# EAGLE design rako-bridge (EAGLE 6.4)
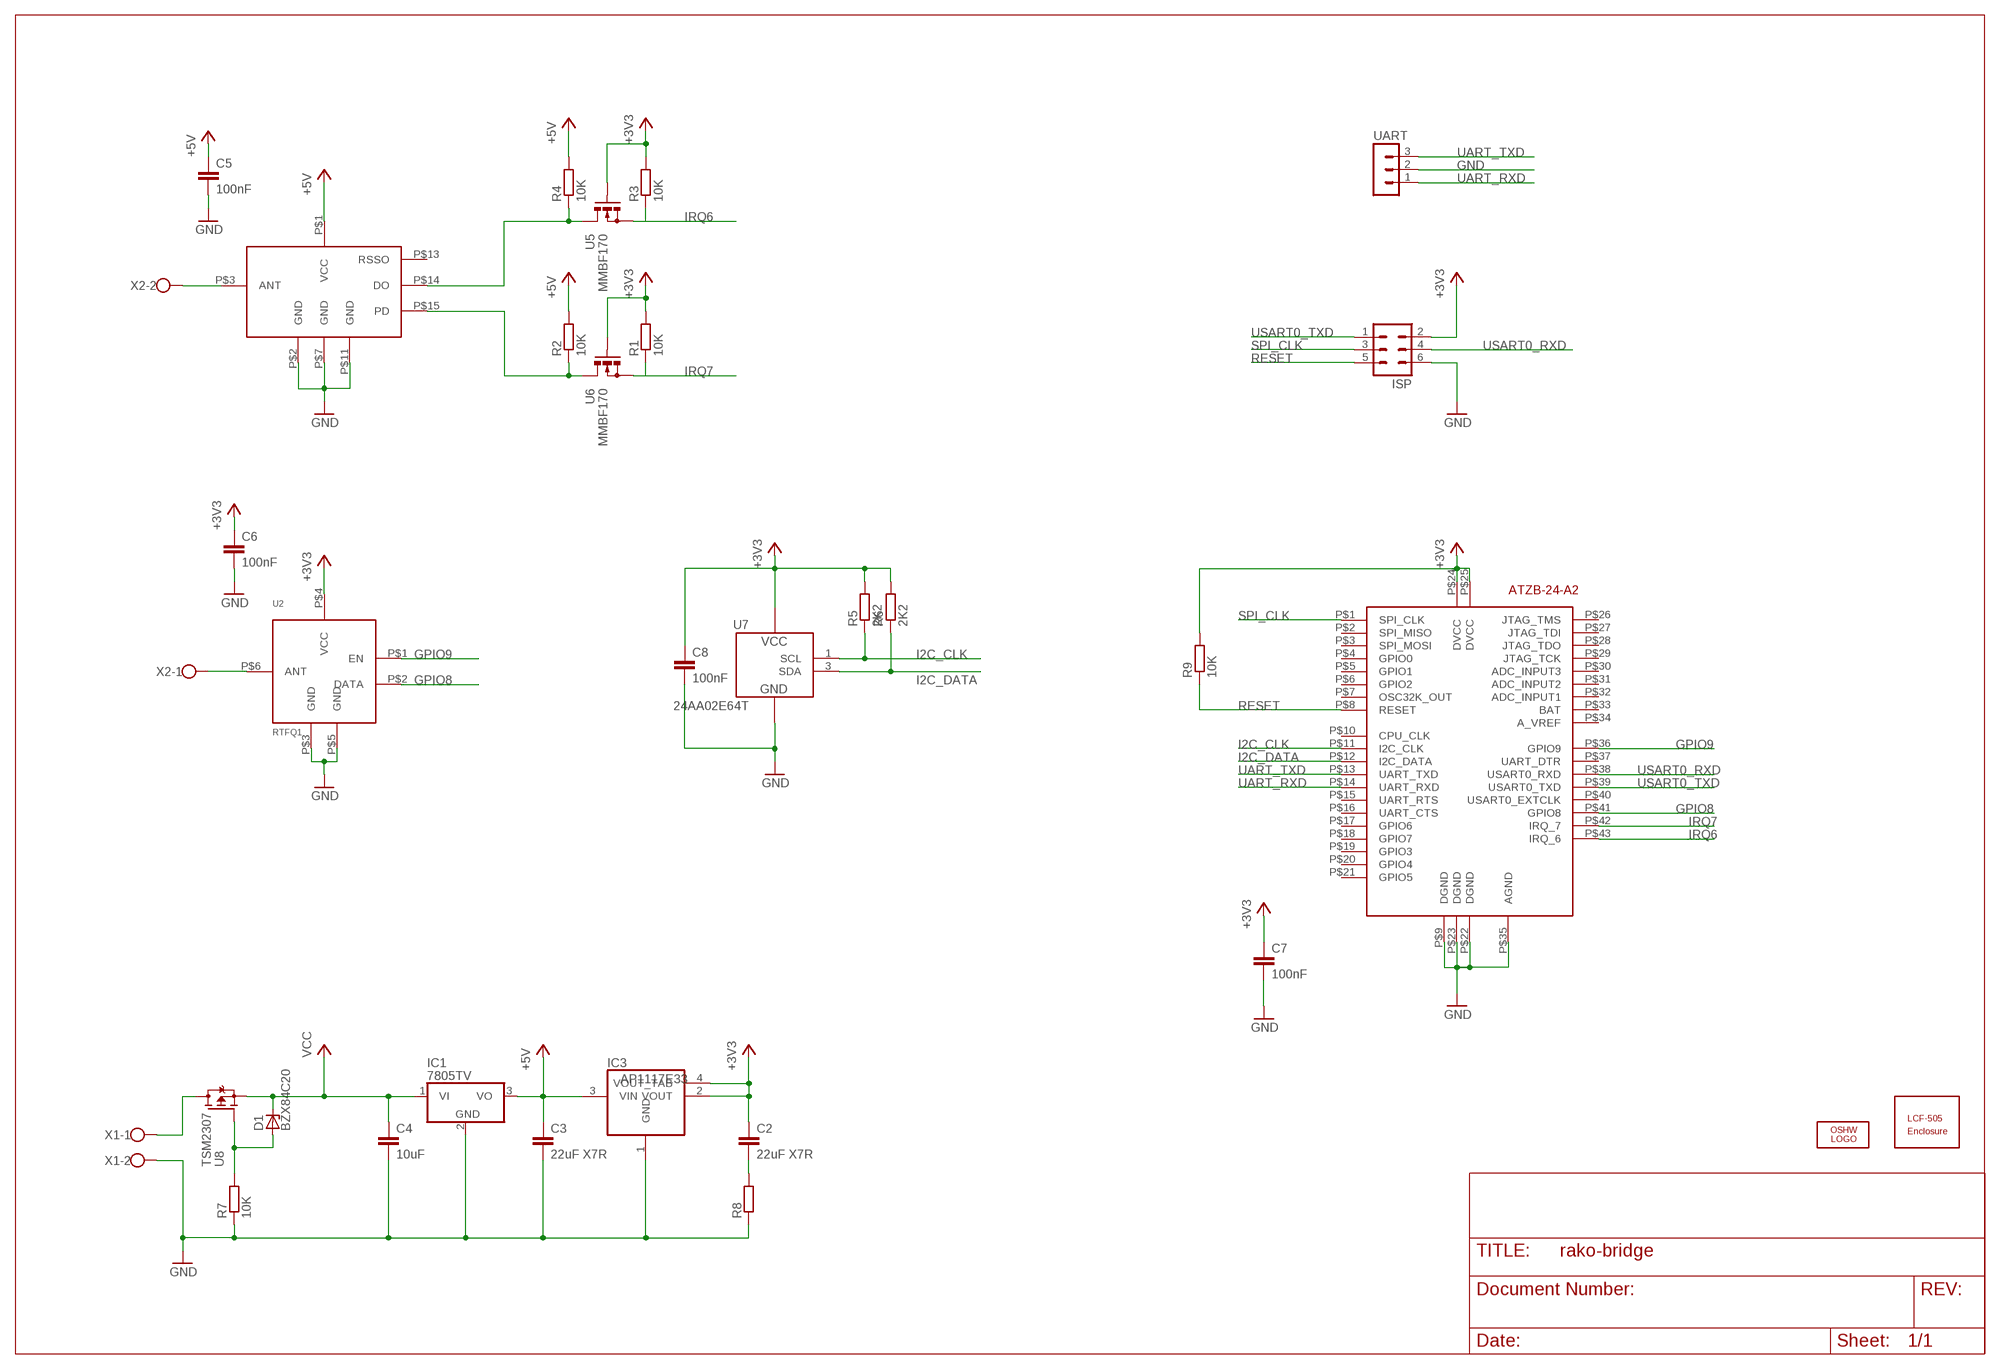
[diagram p0: schematic, sheet 1]

## Parts
C2  22uF X7R  C-EUC1210  [C1210]
C3  22uF X7R  C-EUC1210  [C1210]
C4  10uF  C-EUC1210  [C1210]
C5  100nF  C-EUC0603  [C0603]
C6  100nF  C-EUC0603  [C0603]
C7  100nF  C-EUC0603  [C0603]
C8  100nF  C-EUC0603  [C0603]
D1  BZX84C20  BZX84C  [SOT23]
IC1  7805TV  [TO220V]
IC3  AP1117E33  REG1117  [SOT223]
ISP  MA03-2  [MA03-2]
LOGO1  OSHW_LOGO_FILLX0200-NT  [OSHW_FILLX200_NOTEXT]
R1  10K  R-EU_R0603  [R0603]
R2  10K  R-EU_R0603  [R0603]
R3  10K  R-EU_R0603  [R0603]
R4  10K  R-EU_R0603  [R0603]
R5  2K2  R-EU_R0603  [R0603]
R6  2K2  R-EU_R0603  [R0603]
R7  10K  R-EU_R0603  [R0603]
R8  R-EU_R0603  [R0603]
R9  10K  R-EU_R0603  [R0603]
U2  RTFQ1  [RTFQ1]
U4  RRFQ1  [RRFQ1]
U5  MMBF170  [SOT23]
U6  MMBF170  [SOT23]
U7  24AA02E64T  [SOT23-5L]
U8  TSM2307  [SOT23]
U$1  BOX-LCF-505  [BOX-LCF-505]
U$3  ATZB-24-A2  [ATZB-24-A2]
UART  MA03-1  [MA03-1]
X1  W237-102  [W237-102]
X2  W237-102  [W237-102]

## Nets
+3V3: C2.1 C6.1 C7.1 C8.1 IC3.2(VOUT) IC3.4(VOUT_TAB) ISP.2 R1.2 R3.2 R5.2 R6.2 R9.2 U2.P$4(VCC) U5.1(G) U6.1(G) U7.4(VCC) U$3.P$24(DVCC) U$3.P$25(DVCC)
+5V: C3.1 C5.1 IC1.3(VO) IC3.3(VIN) R2.2 R4.2 U4.P$1(VCC)
GND: C3.2 C4.2 C5.2 C6.2 C7.2 C8.2 IC1.2(GND) IC3.1(GND) ISP.6 R7.1 R8.1 U2.P$3(GND) U2.P$5(GND) U4.P$2(GND) U4.P$7(GND) U4.P$11(GND) U7.2(VSS) U$3.P$9(DGND) U$3.P$22(DGND) U$3.P$23(DGND) U$3.P$35(AGND) UART.2 X1.2
GPIO8: U2.P$2(DATA) U$3.P$41(GPIO8)
GPIO9: U2.P$1(EN) U$3.P$36(GPIO9)
I2C_CLK: R5.1 U7.1(SCL) U$3.P$11(I2C_CLK)
I2C_DATA: R6.1 U7.3(SDA) U$3.P$12(I2C_DATA)
IRQ6: R3.1 U5.2(S) U$3.P$43(IRQ_6)
IRQ7: R1.1 U6.2(S) U$3.P$42(IRQ_7)
N$1: U4.P$3(ANT) X2.2
N$2: U2.P$6(ANT) X2.1
N$3: D1.1(A) R7.2 U8.1(G)
N$4: U8.3(D) X1.1
N$5: R2.1 U4.P$15(PD) U6.3(D)
N$7: R4.1 U4.P$14(DO) U5.3(D)
N$9: C2.2 R8.2
RESET: ISP.5 R9.1 U$3.P$8(RESET)
SPI_CLK: ISP.3 U$3.P$1(SPI_CLK)
UART_RXD: U$3.P$14(UART_RXD) UART.1
UART_TXD: U$3.P$13(UART_TXD) UART.3
USART0_RXD: ISP.4 U$3.P$38(USART0_RXD)
USART0_TXD: ISP.1 U$3.P$39(USART0_TXD)
VCC: C4.1 D1.3(C) IC1.1(VI) U8.2(S)
Unconnected: U4.P$13(RSSO) U$3.P$2(SPI_MISO) U$3.P$3(SPI_MOSI) U$3.P$4(GPIO0) U$3.P$5(GPIO1) U$3.P$6(GPIO2) U$3.P$7(OSC32K_OUT) U$3.P$10(CPU_CLK) U$3.P$15(UART_RTS) U$3.P$16(UART_CTS) U$3.P$17(GPIO6) U$3.P$18(GPIO7) U$3.P$19(GPIO3) U$3.P$20(GPIO4) U$3.P$21(GPIO5) U$3.P$26(JTAG_TMS) U$3.P$27(JTAG_TDI) U$3.P$28(JTAG_TDO) U$3.P$29(JTAG_TCK) U$3.P$30(ADC_INPUT3) U$3.P$31(ADC_INPUT2) U$3.P$32(ADC_INPUT1) U$3.P$33(BAT) U$3.P$34(A_VREF) U$3.P$37(UART_DTR) U$3.P$40(USART0_EXTCLK)

## Library data of the parts
C2-C8 = resistor:C-EU: CAPACITOR, European symbol
D1 = __SR:BZX84C: Z DIODE
IC1 = linear:78*: Positive VOLTAGE REGULATOR Source: http://cache.national.com/ds/LM/LM78L05.pdf http://www.fairchildsemi.com/ds/LM/LM7805.pdf
IC3 = burr-brown:REG1117: 800mA and 1A Low Dropout (LDO) Positive Regulator 1.8V, 2.5V, 2.85V, 3.3V, 5V, and Adj; MPN: REG1117; OC_FARNELL: 1097566; OC_NEWARK: 14P6981
ISP = con-lstb:MA03-2: PIN HEADER; OC_FARNELL: unknown; OC_NEWARK: unknown
LOGO1 = ohw-logo:OSHW_LOGO_FILL
R1-R9 = resistor:R-EU_: RESISTOR, European symbol
U2 = __SR:RTFQ1
U4 = __SR:RRFQ1
U5 U6 = __SR:MMBF170
U7 = __SR:24AA02E64T
U8 = __SR:TSM2307
U$1 = __SR:BOX-LCF-505
U$3 = __SR:ATZB-24-A2
UART = con-lstb:MA03-1: PIN HEADER; OC_FARNELL: unknown; OC_NEWARK: unknown
X1 X2 = con-wago-500:W237-102: WAGO SCREW CLAMP; MPN: 237-102; OC_FARNELL: unknown; OC_NEWARK: 70K9898

## Board
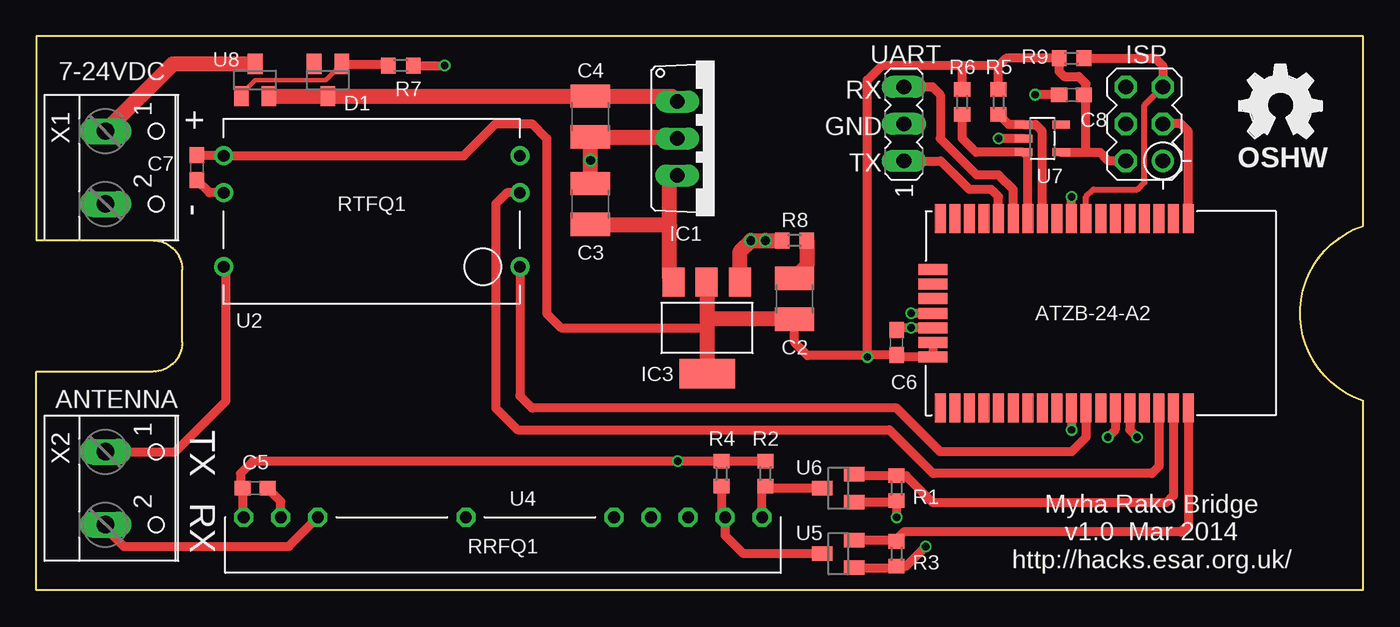
[diagram p1: board, top side]
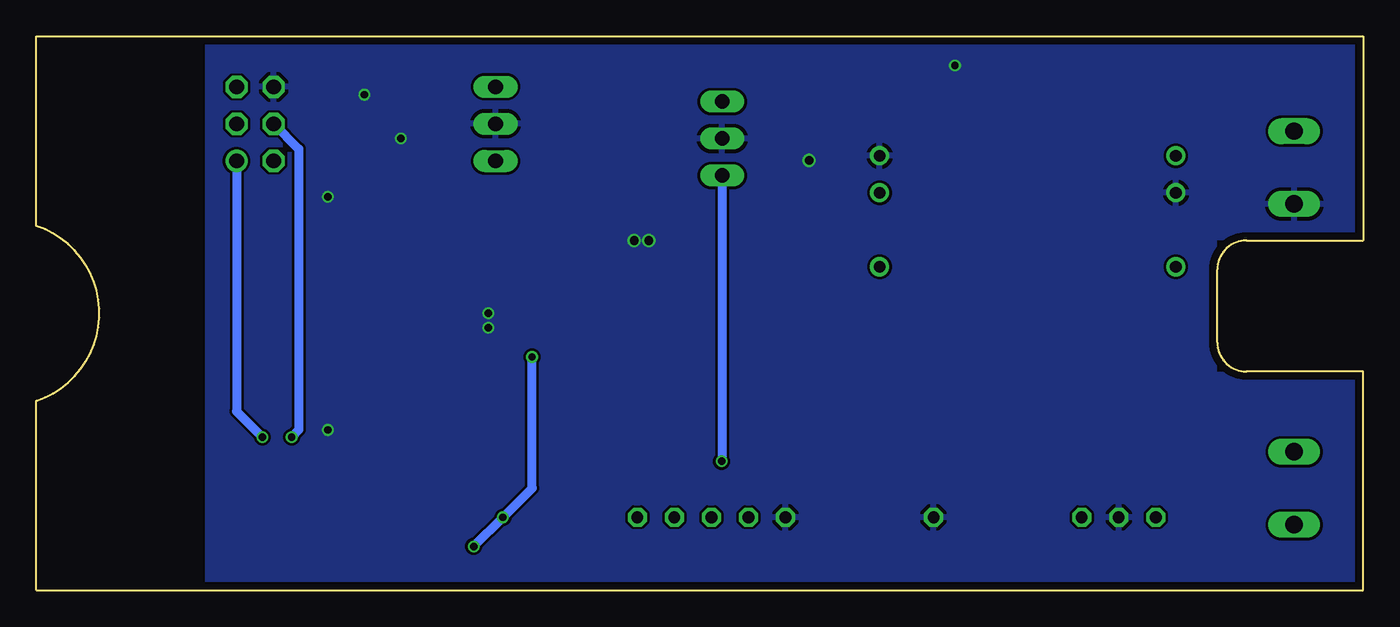
[diagram p2: board, bottom side, seen from below]

Size 91 x 38 mm. Coordinates in mm from the lower left corner, seen from the top.
Copper layers (1*16): Top 0.035mm / dielectric 1.5mm / Bottom 0.035mm
Design rules "EagleRules *": minimum track width 7mil, minimum drill 12mil, track to track 7mil, track to pad 7mil, pad to pad 7mil, via to via 7mil, smd to smd 0mil, copper to edge 20mil, drill to drill 10mil, minimum pad ring 10mil, minimum via ring 6mil, stop-mask expansion 2mil, vias tented up to drill 25mil, thermal gap 10mil

### Footprints (pad centres in the part's own frame; a part is rotated, then mirrored left to right if it is on the bottom)
C1210 = smd 1.6 x 2.7: 1 -1.4,0; 2 1.4,0
C0603 = smd 1.1 x 1: 1 -0.85,0; 2 0.85,0
SOT23 = smd 1 x 1.4: 1 -0.95,-1.1; 2 0.95,-1.1; 3 0,1.1
TO220V = drill 1.016 long: 1 -2.54,-2.54; 2 0,-2.54; 3 2.54,-2.54
SOT223 = smd 1.499 x 2.007: 1 -2.261,-3.15; 2 0.025,-3.15; 3 2.311,-3.15 | smd 3.81 x 2.007: 4 0,3.15
MA03-2 = drill 1.016: 1 -2.54,-1.27 | drill 1.016 octagon: 2 -2.54,1.27; 3 0,-1.27; 4 0,1.27; 5 2.54,-1.27; 6 2.54,1.27
R0603 = smd 1 x 1.1: 1 -0.85,0; 2 0.85,0
RTFQ1 = drill 0.8: P$1 -10.16,3.81; P$2 -10.16,-1.27; P$3 -10.16,-3.81; P$4 10.16,-3.81; P$5 10.16,-1.27; P$6 10.16,3.81
RRFQ1 = drill 0.8 octagon: P$1 -17.78,0; P$2 -15.24,0; P$3 -12.7,0; P$7 -2.54,0; P$11 7.62,0; P$12 10.16,0; P$13 12.7,0; P$14 15.24,0; P$15 17.78,0
SOT23-5L = smd 0.55 x 1.2: 1 -0.95,-1.3; 2 0,-1.3; 3 0.95,-1.3; 4 0.95,1.3; 5 -0.95,1.3
ATZB-24-A2 = smd 0.75 x 2: P$1 6,6.5; P$2 5,6.5; P$3 4,6.5; P$4 3,6.5; P$5 2,6.5; P$6 1,6.5; P$7 0,6.5; P$8 -1,6.5; P$9 -2,6.5; P$10 -3,6.5; P$11 -4,6.5; P$12 -5,6.5; P$13 -6,6.5; P$14 -7,6.5; P$15 -8,6.5; P$16 -9,6.5; P$17 -10,6.5; P$18 -11,6.5; P$26 -11,-6.5; P$27 -10,-6.5; P$28 -9,-6.5; P$29 -8,-6.5; P$30 -7,-6.5; P$31 -6,-6.5; P$32 -5,-6.5; P$33 -4,-6.5; P$34 -3,-6.5; P$35 -2,-6.5; P$36 -1,-6.5; P$37 0,-6.5; P$38 1,-6.5; P$39 2,-6.5; P$40 3,-6.5; P$41 4,-6.5; P$42 5,-6.5; P$43 6,-6.5 | smd 2 x 0.75: P$19 -11.5,3; P$20 -11.5,2; P$21 -11.5,1; P$22 -11.5,0; P$23 -11.5,-1; P$24 -11.5,-2; P$25 -11.5,-3
MA03-1 = drill 1.016 long: 1 -2.54,0; 2 0,0; 3 2.54,0
W237-102 = drill 1.194 long: 1 -2.5,-1.27; 2 2.5,-1.27

### Placement (x,y rotation side)
C2  52,20 90 top
C3  38,26.5 90 top
C4  38,32.5 270 top
C5  15,7 0 top
C6  59,17 90 top
C7  11,29 270 top
C8  71,34 180 top
D1  20,35 180 top
IC1  46.5,31 270 top
IC3  46,18 180 top
ISP  76,32 90 top
LOGO1  82.5,31 0 top
R1  59,7 270 top
R2  50,8 90 top
R3  59,2.5 270 top
R4  47,8 90 top
R5  66,33.5 90 top
R6  63.5,33.5 90 top
R7  25,36 180 top
R8  52,24 0 top
R9  71,36.5 180 top
U2  23,26 180 top
U4  32,5 0 top
U5  55,2.5 90 top
U6  55,7 90 top
U7  69,31 270 top
U8  15,35 0 top
U$1  91,0 90 top
U$3  73,19 0 top
UART  59.5,32 90 top
X1  6,29 270 top
X2  6,7 270 top

### Tracks (layer width: path | path; a pad name or v marks a point on that pad's centre or on a via)
+3V3  (via drill 0.5)
  Top 0.406: 59.15,16 C6.1 | 11.04,29.81 C7.1 | 58.9,6.05 R1.2 | 57.15,16.15 v57,16 | 58.9,1.55 R3.2
  Top 0.61: U$3.P$24 U$3.P$25 59.15,16 | 11.04,29.81 U2.P$4 29.31,29.81 31.5,32 34,32 35,31 35,19 36,18 46,18 | U6.1 58.9,6.05 | R1.2 v59,5 | 66,36 63.5,36 | 63.5,36 58,36 57,35 v57,16 56.9,16.1 52.9,16.1 52,17 C2.1 | C6.1 57.15,16.15 | U5.1 58.9,1.55 | R3.2 59.65,1.65 v61,3 | R6.2 63.5,36 | R5.2 66,36 | 71.55,30.05 U7.4 72,30.05 | 72,30.05 72,34 | C8.1 72,34 | ISP.2 73.54,29.46 72.95,30.05 72,30.05 | 72,34 72,34.75 71.5,35.25 70.5,35.25 70.15,35.6 R9.2 66.5,36.5 66,36
  Top 1.016: IC3.2 46,21.12 46,18.6 | 46,18.6 46,18 IC3.4 | C2.1 46,18.6
  Bottom 0.61: v61,3 v59,5 57,7 v57,16
+5V  (via drill 0.5)
  Top 0.406: 14,7.15 C5.1
  Top 0.61: R2.2 R4.2 v44,8.85 14.85,8.85 14,8 14,7.15 | C5.1 14.15,5.07 U4.P$1
  Top 1.016: IC3.3 43.44,21.4 43.44,25 | 43.44,25 43.44,27.94 IC1.3 | C3.1 43.34,25.1 43.44,25
  Bottom 0.61: IC1.3 43.96,8.89 v44,8.85
GND  (via drill 0.5, 0.6)
  Top 0.61: U$3.P$35 v71,11 | U$3.P$9 v71,27 | U$3.P$23 v60,18 59.15,18 C6.2 | U$3.P$22 v60,19 | U2.P$5 11.88,27.27 C7.2 | U4.P$2 16.76,6.09 C5.2 | R7.1 v28,36 | U7.2 v66,31 | C8.2 v68.5,34
  Top 1.016: R8.1 v50,24 v49,24 48.26,23.26 IC3.1 | C3.2 v38,29.5 C4.2 43.86,31.1 IC1.2
  pour Bottom: 0,0 0,38 79.25,38 79.25,0
GPIO8
  Top 0.61: U$3.P$41 77,8.5 76.5,8 61.5,8 58.5,11 33,11 31.5,12.5 31.5,26.5 32.27,27.27 U2.P$2
GPIO9
  Top 0.61: U$3.P$36 72,10.5 71,9.5 62,9.5 59,12.5 34,12.5 33.16,13.34 U2.P$1
I2C_CLK
  Top 0.61: U$3.P$11 69,31.5 68.55,31.95 U7.1 66.7,31.95 R5.1
I2C_DATA
  Top 0.61: U$3.P$12 68,29.75 U7.3 64.45,30.05 63.5,31 R6.1
IRQ6
  Top 0.406: 58.9,3.45 R3.1
  Top 0.61: U$3.P$43 79,4.5 78.5,4 59.5,4 59,3.5 R3.1 | U5.2 58.9,3.45
IRQ7
  Top 0.406: 56.2,7.85 U6.2
  Top 0.61: 56.2,7.85 R1.1 59.65,7.85 61.5,6 77.5,6 78,6.5 U$3.P$42
N$1
  Top 0.406: X2.2 4.73,4.27
  Top 0.61: 4.73,4.27 6,3 17.3,3 U4.P$3
N$2
  Top 0.61: X2.1 9.5,9.5 13,13 13,22.03 U2.P$6
N$3
  Top 0.305: 14.05,34.05 15,35 19.85,35 D1.1
  Top 0.406: U8.1 14.05,34.05 | 24.05,36.1 R7.2
  Top 0.61: D1.1 24.05,36.1
N$4
  Top 1.016: U8.3 9.33,36.1 X1.1
N$5
  Top 0.406: 50.15,7 R2.1 49.78,6.93
  Top 0.61: U6.3 50.15,7 | U4.P$15 49.78,6.93
N$7
  Top 0.61: R4.1 47,5.24 U4.P$14 47.24,3.76 48.5,2.5 U5.3
N$9
  Top 1.016: R8.2 52.85,22.25 C2.2
RESET
  Top 0.406: U$3.P$8 72,27 72.5,27.5 75.5,27.5 76,28 76,33.27 ISP.5
  Top 0.61: R9.1 76.75,36.5 77.25,36 77.25,34.56 ISP.5
SPI_CLK
  Top 0.61: U$3.P$1 79,31.5 78.5,32 ISP.3
UART_RXD
  Top 0.61: UART.1 62.04,29.46 64,27.5 65.5,27.5 66,27 U$3.P$14
UART_TXD
  Top 0.61: UART.3 61.46,34.54 62,34 62,31 64.5,28.5 66,28.5 67,27.5 U$3.P$13
USART0_RXD  (via drill 0.5)
  Top 0.61: U$3.P$38 74,11 v73.5,10.5
  Bottom 0.61: v73.5,10.5 73,11 73,30.27 ISP.4
USART0_TXD  (via drill 0.5)
  Top 0.61: U$3.P$39 75,11 v75.5,10.5
  Bottom 0.61: 76,11 v75.5,10.5 77.27,12.27 ISP.1
VCC
  Top 1.016: U8.2 D1.3 C4.1 43.6,33.9 IC1.1

### Text on the board
tPlace: 7-24VDC | RX | + | GND | TX | OSHW | - | RTFQ1 | ATZB-24-A2 | ANTENNA | TX | RX | RRFQ1 | Myha Rako Bridge / v1.0 Mar 2014 / http://hacks.esar.org.uk/